# EAGLE design ESP12Block (EAGLE 7.7.0)
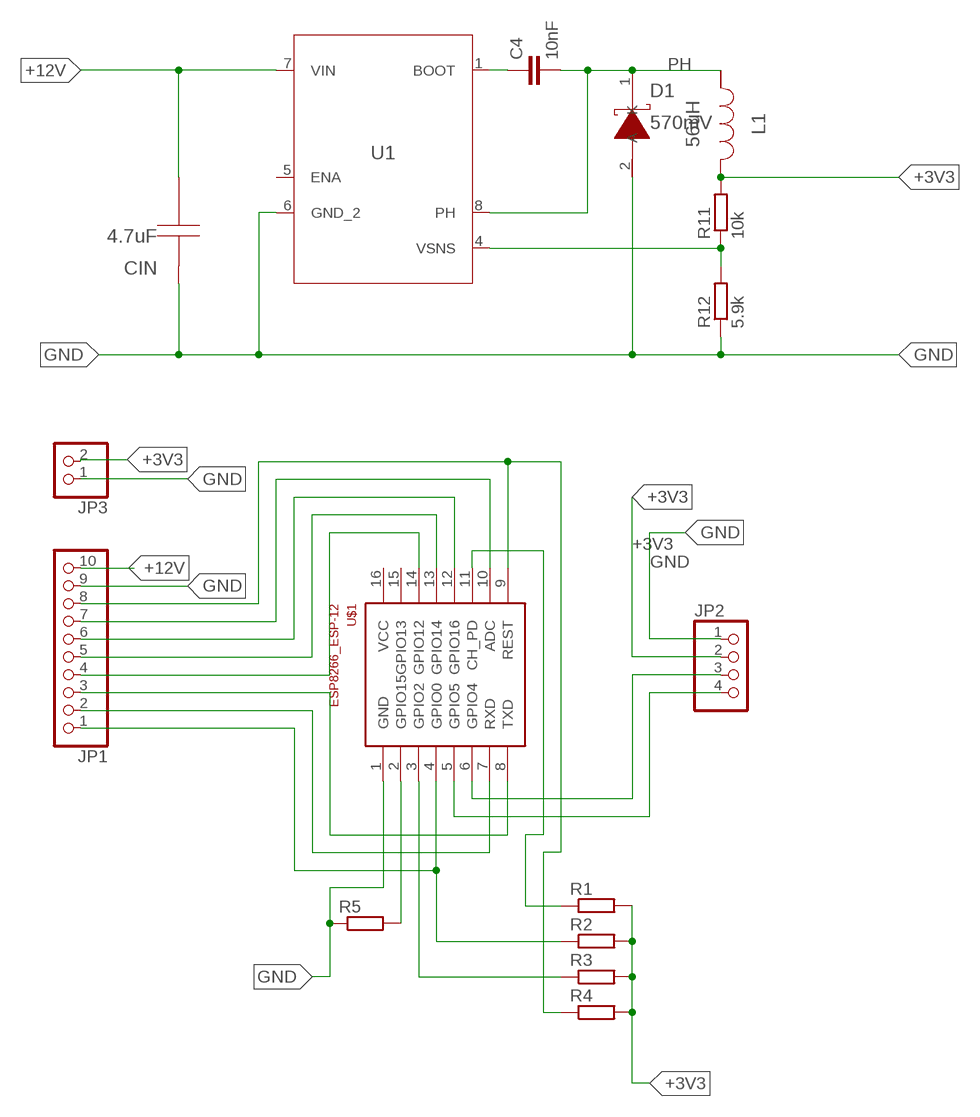
[diagram p0: schematic, sheet 1]

## Parts
C4  10nF  C-EUC0805  [C0805]
CIN  4.7uF  GRM31CR71H475KA12L  [1206]
D1  570mV  PMEG6010CEH,115  [SOD-123F]
JP1  PINHD-1X10_2.00  [1X10M]
JP2  PINHD-1X4_2.54  [1X04]
JP3  PINHD-1X2M  [1X02M]
L1  56uH  NPI75C560KTRF  [IND_NPI75C]
R1  R-EU_M0805  [M0805]
R2  R-EU_M0805  [M0805]
R3  R-EU_M0805  [M0805]
R4  R-EU_M0805  [M0805]
R5  R-EU_M0805  [M0805]
R11  10k  R-EU_R0805  [R0805]
R12  5.9k  R-EU_R0805  [R0805]
U1  TPS5410DR  [M08A]
U$1  ESP8266_ESP-12  [ESP8266-ESP12]

## Nets
+3V3: JP2.2 JP3.2 L1.1 R1.2 R2.2 R3.2 R4.2 R11.2
+12V: CIN.2 JP1.10 U1.7(VIN)
ADC: JP1.7 U$1.10(ADC)
BOOT: C4.1 U1.1(BOOT)
CH_PD: R1.1 U$1.11(CH_PD)
GND: CIN.1 D1.2(A) JP1.9 JP2.1 JP3.1 R5.1 R12.1 U1.6(GND_2) U$1.1(GND)
GPIO0: JP1.1 R2.1 U$1.4(GPIO0)
GPIO2: R3.1 U$1.3(GPIO2)
GPIO4: JP2.3 U$1.6(GPIO4)
GPIO5: JP2.4 U$1.5(GPIO5)
GPIO12: JP1.4 U$1.14(GPIO12)
GPIO14: JP1.5 U$1.13(GPIO14)
GPIO15: R5.2 U$1.2(GPIO15)
GPIO16: JP1.6 U$1.12(GPIO16)
PH: C4.2 D1.1(K) L1.2 U1.8(PH)
RST: JP1.8 R4.1 U$1.9(REST)
RXD: JP1.2 U$1.7(RXD)
SENS: R11.1 R12.2 U1.4(VSNS)
TXD: JP1.3 U$1.8(TXD)
Unconnected: U1.5(ENA) U$1.15(GPIO13) U$1.16(VCC)

## Library data of the parts
C4 = resistor:C-EU: CAPACITOR, European symbol
CIN = AcceleratedDesigns_Lib:GRM31CR71H475KA12L; CAP: 4.7E6; ESR: 0.0; IRMS: 0.0; MANUFACTURER_NAME: MuRata; MANUFACTURER_PART_NUMBER: GRM31CR71H475KA12L; VDC: 50.0; VENDOR: MuRata
D1 = AcceleratedDesigns_Lib:PMEG6010CEH,115; DATASHEETURL: httpwww.nxp.comdocumentsdata%5FsheetPMEG6010CEH%5FPMEG6010CEJ.pdf; IO: 1.0; MANUFACTURER_NAME: Nexperia; MANUFACTURER_PART_NUMBER: PMEG6010CEH115; VENDOR: NXP Semiconductor; VFATIO: 0.57; VRRM: 60.0
JP1 = pinhead-1:PINHD-1X10: PIN HEADER
JP2 = pinhead-1:PINHD-1X4: PIN HEADER
JP3 = pinhead:PINHD-1X2: PIN HEADER
L1 = AcceleratedDesigns_Lib:NPI75C560KTRF; DCR: 0.24; IDC: 0.94; L: 5.6E5; MANUFACTURER_NAME: NIC Components; MANUFACTURER_PART_NUMBER: NPI75C560KTRF; VENDOR: NIC Components
R1-R5 = rcl:R-EU_: RESISTOR, European symbol
R11 R12 = resistor:R-EU_: RESISTOR, European symbol
U1 = AcceleratedDesigns_Lib:TPS5410DR; DATASHEETURL: httpwww.ti.comproducttps5410; FREQUENCY: 500000.0; IMAX: 1.0; MANUFACTURER_NAME: Texas Instruments; MANUFACTURER_PART_NUMBER: TPS5410DR; MKTG_PACKAGE: TPS5410; NSID: TPS5410D; PACKAGE: TPS5410; VENDOR: Texas Instruments
U$1 = ESP8266-ESP12:ESP8266_ESP-12

## Board
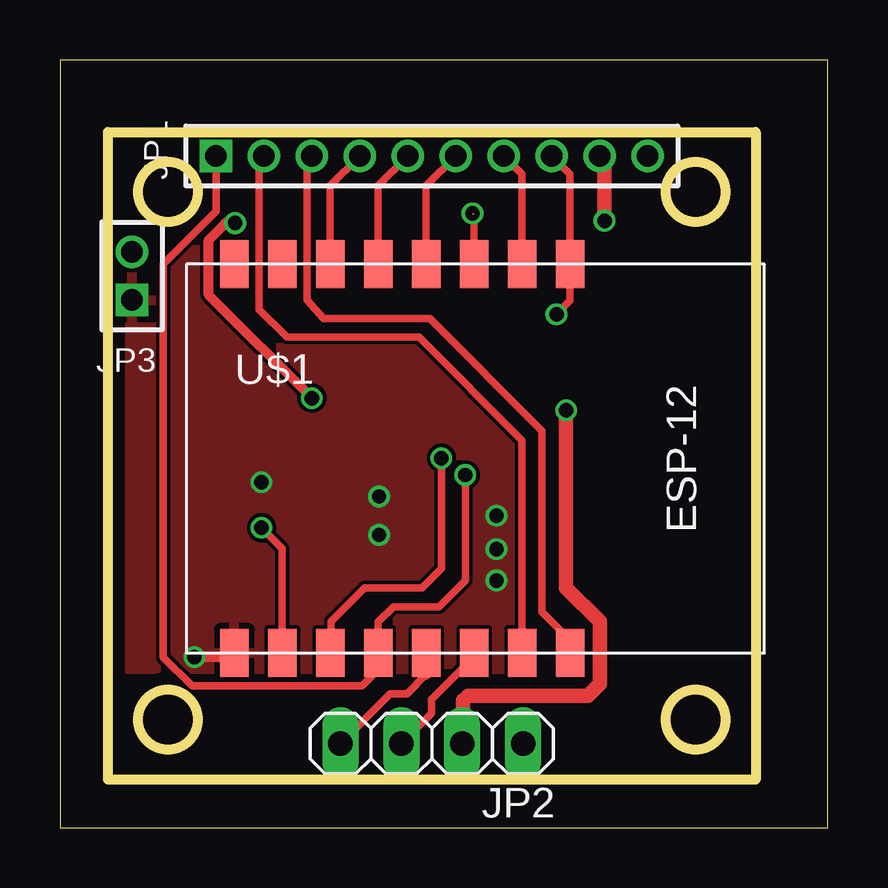
[diagram p1: board, top side]
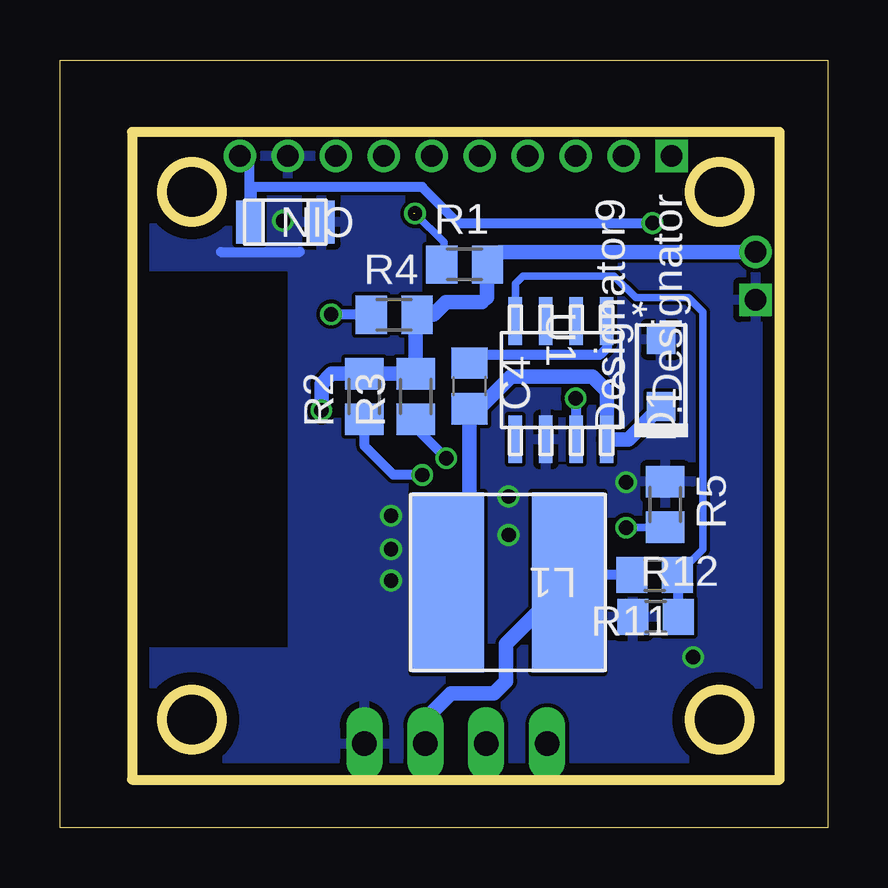
[diagram p2: board, bottom side, seen from below]

Size 32 x 32 mm. Coordinates in mm from the lower left corner, seen from the top.
Outline: 0,0 32,0 32,32 0,32 0,0
Outline: 29,2 2,2 2,29 29,29 29,2
Outline: circle at 4.5,26.5 radius 1.25
Outline: circle at 26.5,26.5 radius 1.25
Outline: circle at 4.5,4.5 radius 1.25
Outline: circle at 26.5,4.5 radius 1.25
Copper layers (1*16): Top 0.035mm / dielectric 1.6mm / Bottom 0.035mm
Design rules "Elecrow_2-layer_PCB_eagle_rule": minimum track width 6mil, minimum drill 12mil, track to track 6mil, track to pad 8mil, pad to pad 12mil, via to via 12mil, smd to smd 0mil, copper to edge 20mil, drill to drill 10mil, minimum pad ring 6mil, minimum via ring 6mil, stop-mask expansion 0mil, vias tented up to drill 100mil, thermal gap 10mil

### Footprints (pad centres in the part's own frame; a part is rotated, then mirrored left to right if it is on the bottom)
C0805 = smd 1.3 x 1.5: 1 -0.95,0; 2 0.95,0
1206 = smd 1.118 x 1.803: 1 -1.499,0; 2 1.499,0
SOD-123F = smd 1.2 x 1.2: 1 -1.4,0; 2 1.4,0
1X10M = drill 0.914 square: 1 -9,0 | drill 0.914: 2 -7,0; 3 -5,0; 4 -3,0; 5 -1,0; 6 1,0; 7 3,0; 8 5,0; 9 7,0; 10 9,0
1X04 = drill 1.016 long: 1 -3.81,0; 2 -1.27,0; 3 1.27,0; 4 3.81,0
1X02M = drill 0.914 square: 1 -1,0 | drill 0.914: 2 1,0
IND_NPI75C = smd 2.997 x 7.493: 1 -2.502,0; 2 2.502,0
M0805 = smd 1.3 x 1.6: 1 -0.95,0; 2 0.95,0
R0805 = smd 1.3 x 1.5: 1 -0.95,0; 2 0.95,0
M08A = smd 1.981 x 0.559: 1 -2.464,1.905; 2 -2.464,0.635; 3 -2.464,-0.635; 4 -2.464,-1.905; 5 2.464,-1.905; 6 2.464,-0.635; 7 2.464,0.635; 8 2.464,1.905
ESP8266-ESP12 = smd 2 x 1.2: 1 16.2,2; 2 16.2,4; 3 16.2,6; 4 16.2,8; 5 16.2,10; 6 16.2,12; 7 16.2,14; 8 16.2,16; 9 0,16; 10 0,14; 11 0,12; 12 0,10; 13 0,8; 14 0,6; 15 0,4; 16 0,2

### Placement (x,y rotation side)
C4  14.93,18.41 270 bottom
CIN  22.6,25.24 180 bottom
D1  6.94,18.95 90 bottom
JP1  15.5,28 0 top
JP2  15.5,3.5 180 top
JP3  3,23 90 top
L1  13.33,10.22 180 bottom
R1  15.13,23.47 0 bottom
R2  19.32,17.97 90 bottom
R3  17.17,17.97 90 bottom
R4  18.07,21.38 0 bottom
R5  6.77,13.47 270 bottom
R11  7.21,10.53 180 bottom
R12  7.17,8.79 0 bottom
U1  11.11,18.65 270 bottom
U$1  5.27,23.48 270 top

### Tracks (layer width: path | path; a pad name or v marks a point on that pad's centre or on a via)
+3V3  (via drill 0.6 pad 0.25)
  Top 0.406: 16.8,3.53 JP2.2
  Top 0.61: 16.8,3.53 16.8,5.3 17,5.5 22,5.5 22.5,6 22.5,8.6 21.1,10 v21.1,17.4
  Bottom 0.406: R11.2 10.52,10.53 arc-90 L1.1 | 14.2,23.49 R1.2 13.65,24
  Bottom 0.61: JP2.2 16.77,4.53 15.7,5.6 13.9,5.6 13.4,6.1 13.4,7.65 L1.1 | JP3.2 13.65,24 | R1.2 14.2,23.45 14.2,22.1 14.4,21.9 15.9,21.9 16.42,21.38 R4.2 17.17,21.33 R3.2 R2.2 20.68,18.92 21.1,18.5 v21.1,17.4
+12V  (via drill 0.6 pad 0.25)
  Top 0.406: v10.5,17.9 6.2,22.2 6.2,24.5 6.9,25.2 v7.3,25.2
  Bottom 0.406: 24.1,26.8 CIN.2 24.1,25.9 24,26 24,26.6 24.1,26.7 | 24.1,26.8 24.1,27.6 JP1.10 | 24.1,26.8 24,26.7 16.9,26.7 15.4,25.2 v7.3,25.2 | U1.7 10.48,17.88 v10.5,17.9
ADC
  Top 0.305: JP1.7 19.27,27.23 U$1.10
BOOT
  Bottom 0.406: U1.1 9.2,20 9.5,19.7 14.59,19.7 arc-90 C4.1
CH_PD  (via drill 0.6 pad 0.25)  (1 unrouted)
  Top 0.305: U$1.11 17.27,25.6
  Bottom 0.305: 16,24 16,24.4 v17.2,25.6
  Bottom 0.406: R1.1 16.08,24 16,24
GND  (via drill 0.6, 0.6 pad 0.25)
  Top 0.406: U$1.1 7.09,7.1 v5.6,7.1
  Top 0.61: JP1.9 22.7,27.8 v22.7,25.3
  Bottom 0.406: 25.3,24 22,24
  other vias: 8.4,14.4 18.2,13 18.2,11.6 18.2,10.3 13.3,13.8 13.3,12.2
  pour Bottom: 2,29.1 29.1,29.1 29.1,23.4 22.3,23.4 22.3,7.3 29.1,7.3 29.1,2 2,2 2,28.9
  pour Top: 1.9,25.3 21.3,25.3 21.3,6.6 2,6.6 2,13.2
GPIO0  (via drill 0.6 pad 0.25)
  Top 0.305: U$1.4 13.27,8.57 13.9,9.2 15.8,9.2 16.9,10.3 v16.9,14.7 | JP1.1 6.5,25.7 4.3,23.5 4.3,7.1 5.5,5.9 12.6,5.9 13.18,6.48
  Top 0.406: U$1.4 13.18,7.28 13.18,6.48
  Bottom 0.406: v16.9,14.7 18.1,14.7 19.3,15.9 19.3,17 R2.1
GPIO2  (via drill 0.6 pad 0.25)
  Top 0.305: 11.3,7.31 11.3,8.6 12.7,10 15.1,10 15.9,10.8 v15.9,15.4
  Top 0.406: 11.3,7.31 U$1.3
  Bottom 0.406: R3.1 17.17,16.67 v15.9,15.4
GPIO4
  Top 0.305: JP2.3 15.5,4.77 15.5,5.34 17.27,7.11
  Top 0.406: 17.27,7.11 U$1.6
GPIO5
  Top 0.305: JP2.4 13.76,5.57 14.46,5.57 15.27,6.38
  Top 0.406: 15.27,6.38 U$1.5
GPIO12
  Top 0.305: JP1.4 11.27,26.77 U$1.14
GPIO14
  Top 0.305: JP1.5 13.27,26.77 U$1.13
GPIO15  (via drill 0.6 pad 0.25)
  Top 0.305: U$1.2 9.27,11.63 v8.4,12.5
  Bottom 0.305: R5.2 8.38,12.52
  Bottom 0.406: 8.38,12.52 v8.4,12.5
GPIO16
  Top 0.305: JP1.6 15.27,26.77 U$1.12
PH
  Bottom 0.406: L1.2 15.43,10.22 14.93,10.72 | 14.54,17.46 C4.2
  Bottom 0.61: D1.1 8.3,16.19 U1.8 9.2,18.2 9.8,18.8 13.2,18.8 14.54,17.46 | 14.93,10.72 C4.2
RST  (via drill 0.6 pad 0.25)
  Top 0.305: JP1.8 21.27,27.23 U$1.9 21.27,21.97 v20.7,21.4
  Bottom 0.406: R4.1 20.68,21.38 v20.7,21.4
RXD
  Top 0.305: JP1.2 8.3,27.7 8.3,21.6 9.46,20.44 14.96,20.44 19.27,16.13 U$1.7
SENS
  Bottom 0.305: U1.4 13.02,22.68 12.7,23 8.9,23 8,22.1 5.8,22.1 5.2,21.5 5.2,11.59 R11.1
  Bottom 0.406: R12.2 6.22,10.49 R11.1
TXD
  Top 0.305: JP1.3 10.3,27.7 10.3,22 10.99,21.21 15.43,21.21 20.1,16.54 20.1,9 21.27,7.83
  Top 0.406: 21.27,7.83 U$1.8